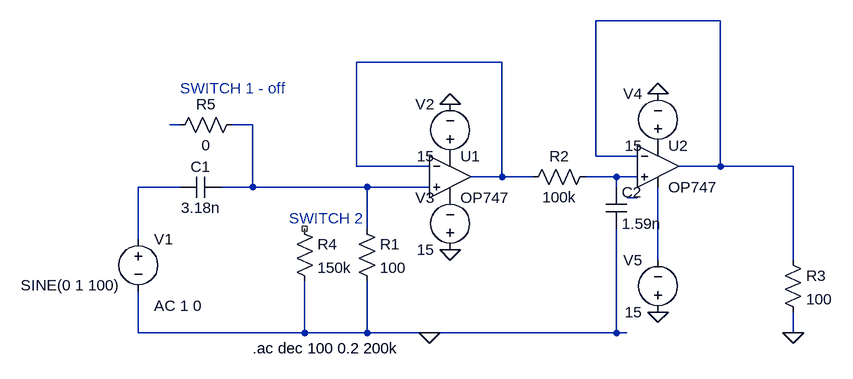
[diagram p0: schematic audio_tone_controller.asc]
audio_tone_controller.asc, the LTspice schematic file:
Version 4
SHEET 1 1076 680
WIRE 896 96 704 96
WIRE 560 160 336 160
WIRE 64 256 48 256
WIRE 176 256 144 256
WIRE 704 304 704 96
WIRE 768 304 704 304
WIRE 336 320 336 160
WIRE 448 320 336 320
WIRE 896 320 896 96
WIRE 896 320 832 320
WIRE 1008 320 896 320
WIRE 560 336 560 160
WIRE 560 336 512 336
WIRE 608 336 560 336
WIRE 736 336 688 336
WIRE 768 336 736 336
WIRE 64 352 0 352
WIRE 176 352 176 256
WIRE 176 352 128 352
WIRE 352 352 176 352
WIRE 448 352 352 352
WIRE 736 352 736 336
WIRE 768 368 752 368
WIRE 352 416 352 352
WIRE 0 432 0 352
WIRE 800 464 800 352
WIRE 1008 464 1008 320
WIRE 0 576 0 512
WIRE 256 576 256 496
WIRE 256 576 0 576
WIRE 352 576 352 496
WIRE 352 576 256 576
WIRE 448 576 352 576
WIRE 736 576 736 416
WIRE 736 576 448 576
WIRE 752 576 736 576
WIRE 1008 576 1008 544
FLAG 448 576 0
FLAG 480 448 0
FLAG 480 224 0
FLAG 1008 576 0
FLAG 800 544 0
FLAG 800 208 0
SYMBOL Voltage 0 416 R0
WINDOW 123 24 118 Left 2
WINDOW 3 -181 87 Left 2
SYMATTR Value2 AC 1 0
SYMATTR Value SINE(0 1 100)
SYMATTR InstName V1
SYMBOL Cap 128 336 R90
WINDOW 0 0 32 VBottom 2
WINDOW 3 32 32 VTop 2
SYMATTR InstName C1
SYMATTR Value 3.18n
SYMBOL Res 704 320 R90
WINDOW 0 0 56 VBottom 2
WINDOW 3 32 56 VTop 2
SYMATTR InstName R2
SYMATTR Value 100k
SYMBOL Cap 720 352 R0
SYMATTR InstName C2
SYMATTR Value 1.59n
SYMBOL Voltage 480 320 R180
WINDOW 0 24 96 Left 2
WINDOW 3 24 16 Left 2
SYMATTR InstName V2
SYMATTR Value 15
SYMBOL Voltage 480 464 R180
WINDOW 0 24 96 Left 2
WINDOW 3 24 16 Left 2
SYMATTR InstName V3
SYMATTR Value 15
SYMBOL OpAmps/OP747 480 272 R0
SYMATTR InstName U1
SYMBOL Res 992 448 R0
SYMATTR InstName R3
SYMATTR Value 100
SYMBOL Res 336 400 R0
SYMATTR InstName R1
SYMATTR Value 100
SYMBOL OpAmps/OP747 800 256 R0
SYMATTR InstName U2
SYMBOL Voltage 800 304 R180
WINDOW 0 24 96 Left 2
WINDOW 3 24 16 Left 2
SYMATTR InstName V4
SYMATTR Value 15
SYMBOL Voltage 800 560 R180
WINDOW 0 24 96 Left 2
WINDOW 3 24 16 Left 2
SYMATTR InstName V5
SYMATTR Value 15
SYMBOL Res 240 400 R0
SYMATTR InstName R4
SYMATTR Value 150k
SYMBOL Res 160 240 R90
WINDOW 0 0 56 VBottom 2
WINDOW 3 32 56 VTop 2
SYMATTR InstName R5
SYMATTR Value 0
TEXT 176 600 Left 2 !.ac dec 100 0.2 200k
TEXT 232 400 Left 2 ;SWITCH 2
TEXT 64 200 Left 2 ;SWITCH 1 - off

The netlist it stands for:
* audio_tone_controller.asc
V1 N006 0 SINE(0 1 100) AC 1 0
C1 N004 N006 3.18n
R2 N005 N002 100k
C2 N005 0 1.59n
V2 P001 0 15
V3 0 P002 15
XU1 N004 N002 P001 P002 N002 OP747  ; pins In+ In- V+ V- OUT
R3 N001 0 100
R1 N004 0 100
XU2 N005 N001 P003 N008 N001 OP747  ; pins In+ In- V+ V- OUT
V4 P003 0 15
V5 0 N008 15
R4 NC_01 0 150k
R5 N004 N003 0
.ac dec 100 0.2 200k
* SWITCH 2
* SWITCH 1 - off
.backanno
.end